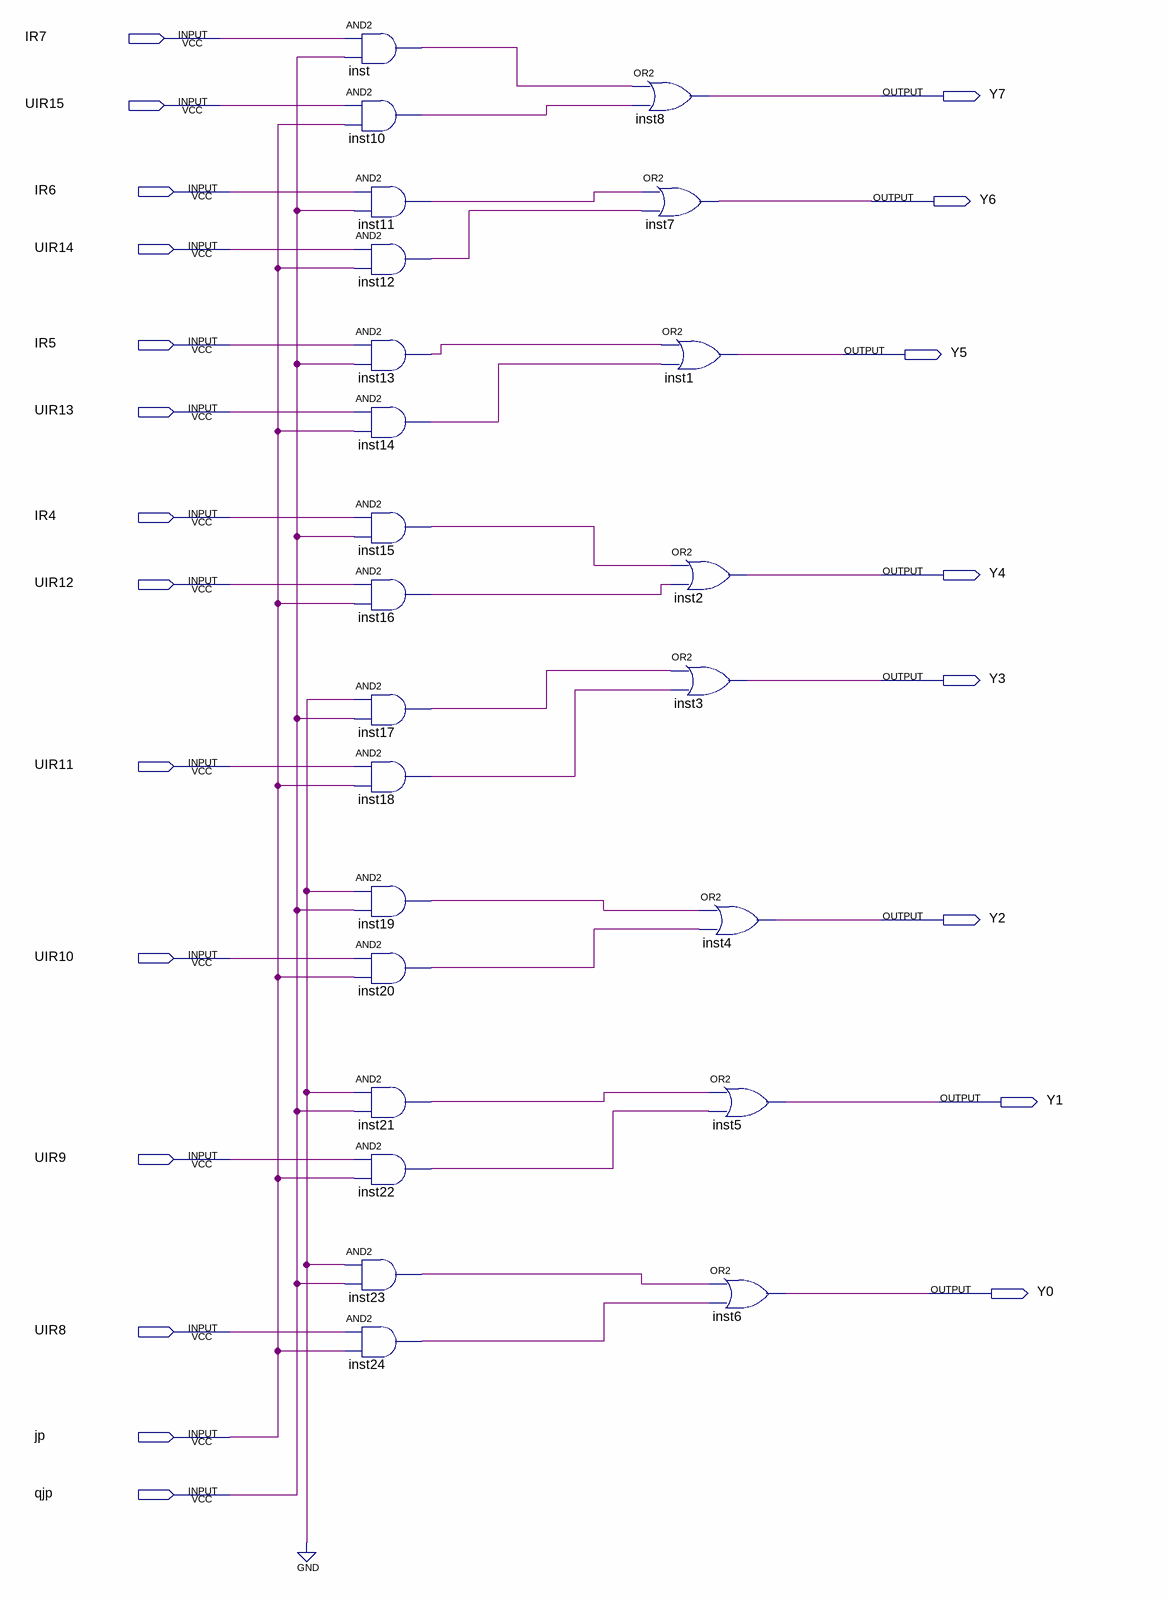
[diagram p0: schematic sheet]
// Quartus schematic weidizhi.bdf as structural Verilog: 24 symbols, 22 pins
module weidizhi (
  input  IR7,
  input  UIR15,
  input  IR6,
  input  UIR14,
  input  IR5,
  input  UIR13,
  input  IR4,
  input  UIR12,
  input  UIR11,
  input  UIR10,
  input  UIR9,
  input  UIR8,
  input  jp,
  input  qjp,
  output Y7,
  output Y6,
  output Y5,
  output Y4,
  output Y3,
  output Y2,
  output Y1,
  output Y0
);

  wire inst10_out, inst11_out, inst12_out, inst13_out, inst14_out, inst15_out, inst16_out, inst17_out,
       inst18_out, inst19_out, inst20_out, inst21_out, inst22_out, inst23_out, inst24_out, inst_out;

  and inst (inst_out, IR7, qjp);
  and inst10 (inst10_out, UIR15, jp);
  and inst23 (inst23_out, 1'b0, qjp);
  and inst24 (inst24_out, UIR8, jp);
  and inst11 (inst11_out, IR6, qjp);
  and inst12 (inst12_out, UIR14, jp);
  and inst13 (inst13_out, IR5, qjp);
  and inst14 (inst14_out, UIR13, jp);
  and inst15 (inst15_out, IR4, qjp);
  and inst16 (inst16_out, UIR12, jp);
  and inst17 (inst17_out, 1'b0, qjp);
  and inst18 (inst18_out, UIR11, jp);
  and inst19 (inst19_out, 1'b0, qjp);
  and inst20 (inst20_out, UIR10, jp);
  and inst21 (inst21_out, 1'b0, qjp);
  and inst22 (inst22_out, UIR9, jp);
  or inst8 (Y7, inst_out, inst10_out);
  or inst7 (Y6, inst11_out, inst12_out);
  or inst1 (Y5, inst13_out, inst14_out);
  or inst2 (Y4, inst15_out, inst16_out);
  or inst3 (Y3, inst17_out, inst18_out);
  or inst4 (Y2, inst19_out, inst20_out);
  or inst5 (Y1, inst21_out, inst22_out);
  or inst6 (Y0, inst23_out, inst24_out);
endmodule
